# Altium schematic sheet PSU_VCC1V8AUX_Buck.SchDoc
size A3; SheetNumber: 6; SheetTotal: 32
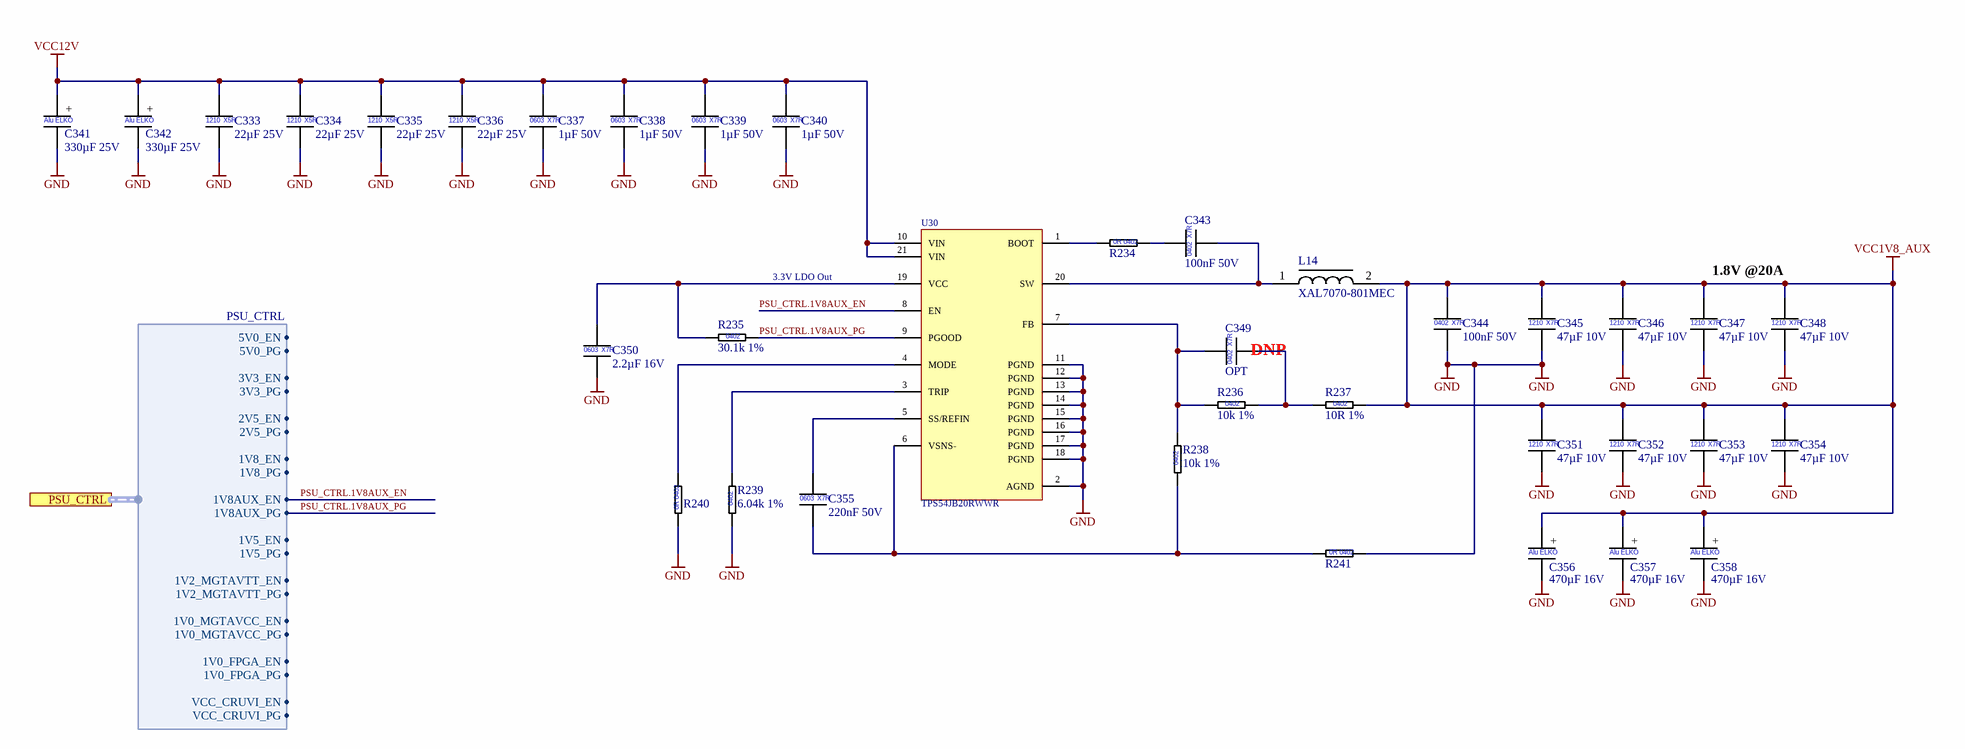
[diagram p0: PSU_VCC1V8AUX_Buck.SchDoc]

## Parts
C333  22µF 25V  [CAP_1210]
C334  22µF 25V  [CAP_1210]
C335  22µF 25V  [CAP_1210]
C336  22µF 25V  [CAP_1210]
C337  1µF 50V  [CAP_0603]
C338  1µF 50V  [CAP_0603]
C339  1µF 50V  [CAP_0603]
C340  1µF 50V  [CAP_0603]
C341  330µF 25V  [WCAP-PTG5_D10H12.5]
C342  330µF 25V  [WCAP-PTG5_D10H12.5]
C343  100nF 50V  [CAP_0402]
C344  100nF 50V  [CAP_0402]
C345  47µF 10V  [CAP_1210]
C346  47µF 10V  [CAP_1210]
C347  47µF 10V  [CAP_1210]
C348  47µF 10V  [CAP_1210]
C349  OPT  [CAP_0402]  (no BOM)
C350  2.2µF 16V  [CAP_0603]
C351  47µF 10V  [CAP_1210]
C352  47µF 10V  [CAP_1210]
C353  47µF 10V  [CAP_1210]
C354  47µF 10V  [CAP_1210]
C355  220nF 50V  [CAP_0603]
C356  470µF 16V  [WCAP-PTG5_D8H13]
C357  470µF 16V  [WCAP-PTG5_D8H13]
C358  470µF 16V  [WCAP-PTG5_D8H13]
L14  XAL7070-801MEC  [COILCRAFT_XAL7070]
R234  0R Jumper  [RES_0402]  (value not drawn)
R235  30.1k 1%  [RES_0402]
R236  10k 1%  [RES_0402]
R237  10R 1%  [RES_0402]
R238  10k 1%  [RES_0402]
R239  6.04k 1%  [RES_0402]
R240  0R Jumper  [RES_0402]  (value not drawn)
R241  0R Jumper  [RES_0402]  (value not drawn)
U30  TPS54JB20RWWR  [VQFN-HR21_RWW0021A]

## Ports
PSU_CTRL (harness PSU_CTRL, see Power-Tree[2B], PSU_MGTAVCC_Buck[1B], PSU_MGTAVTT_Buck[1B], PSU_VCC1V0_FPGA_Buck[1B], PSU_VCC1V5_Buck[1B], PSU_VCC1V8_Buck[1B], PSU_VCC2V5_Buck[1B], PSU_VCC3V3_Buck[1B], PSU_VCC5V_Buck[1B], PSU_VCC_CRUVI_ADJ_Buck[1B])

## Harnesses
PSU_CTRL: 5V0_EN, 5V0_PG, 3V3_EN, 3V3_PG, 2V5_EN, 2V5_PG, 1V8_EN, 1V8_PG, 1V8AUX_EN, 1V8AUX_PG, 1V5_EN, 1V5_PG, 1V2_MGTAVTT_EN, 1V2_MGTAVTT_PG, 1V0_MGTAVCC_EN, 1V0_MGTAVCC_PG, 1V0_FPGA_EN, 1V0_FPGA_PG, VCC_CRUVI_EN, VCC_CRUVI_PG

## Nets
GND: C333.2 C334.2 C335.2 C336.2 C337.2 C338.2 C339.2 C340.2 C341.2 C342.2 C344.2 C345.2 C346.2 C347.2 C348.2 C350.2 C351.2 C352.2 C353.2 C354.2 C356.2 C357.2 C358.2 R239.1 R240.1 R241.2 U30.2(AGND) U30.11(PGND) U30.12(PGND) U30.13(PGND) U30.14(PGND) U30.15(PGND) U30.16(PGND) U30.17(PGND) U30.18(PGND)
VCC1V8_AUX: C344.1 C345.1 C346.1 C347.1 C348.1 C351.1 C352.1 C353.1 C354.1 C356.1 C357.1 C358.1 L14.2 R237.2
VCC12V: C333.1 C334.1 C335.1 C336.1 C337.1 C338.1 C339.1 C340.1 C341.1 C342.1 U30.10(VIN) U30.21(VIN)
PSU_CTRL.1V8AUX_EN: U30.8(EN) ; port PSU_CTRL.1V8AUX_EN
PSU_CTRL.1V8AUX_PG: R235.2 U30.9(PGOOD) ; port PSU_CTRL.1V8AUX_PG
NetC343_1: C343.1 R234.2
NetC343_2: C343.2 L14.1 U30.20(SW)
NetC349_1: C349.1 R236.1 R238.2 U30.7(FB)
NetC349_2: C349.2 R236.2 R237.1
NetC350_1: C350.1 R235.1 U30.19(VCC)
NetC355_1: C355.1 U30.5(SS/REFIN)
NetC355_2: C355.2 R238.1 R241.1 U30.6(VSNS-)
NetR234_1: R234.1 U30.1(BOOT)
NetR239_2: R239.2 U30.3(TRIP)
NetR240_2: R240.2 U30.4(MODE)

## Notes on the sheet
- 3.3V LDO Out
- (near C348) 1.8V @20A
- (near C349) DNP
- Company:
- Contact:
- Customer:
- mail@pcb-arts.com
- PCB Arts GmbH
- Title:
- Project:
- The  information  contained  in  these  documents  is  confidential,  privileged  and  only  for  the information of the intended recipient and may not be used, published or redistributed Without the prior written consent from PCB Arts GmbH.
- Engineer:
- Document Number:
- Revision:
- Variant:
- Date:
- Time:
- Sheet:
- Status:
- /
- (in symbol CAP_0402_100nF_50V) X7R; 0402
- (in symbol CAP_0402_OPT) X7R; 0402
- (in symbol CAP_0603_1µF_50V_X7R_10%) 0603; X7R
- (in symbol CAP_0603_2.2µF_16V_X7R_10%) 0603; X7R
- (in symbol CAP_0603_220nF_50V_X7R_10%) 0603; X7R
- (in symbol CAP_1210_22µF_25V) 1210; X5R
- (in symbol CAP_1210_47µF_10V_X7R_10%) 1210; X7R
- (in symbol CAP_D8L9_470µF_16V) +; Alu ELKO
- (in symbol CAP_D10L12.5_330µF_25V) +; Alu ELKO
- (in symbol RES_0402_0R Jumper) 0R 0402
- (in symbol RES_0402_6.04k_1%) 0402
- (in symbol RES_0402_10k_1%) 0402
- (in symbol RES_0402_10R_1%) 0402
- (in symbol RES_0402_30.1k_1%) 0402

## Library data of the parts
C333-C336 = CAP_1210_22µF_25V: Multilayer Ceramic Capacitors MLCC - SMD/SMT 1210 25VDC; Manufacturer 1: KEMET; Manufacturer 1 Prt. Nr.: C1210C226K3PACTU; Manufacturer 2 Prt. Nr.: TMK212BBJ226MG-TT; Manufacturer 2: Taiyo Yuden
C337-C340 = CAP_0603_1µF_50V_X7R_10%: Multilayer Ceramic Capacitors MLCC - SMD/SMT 50V 1uF X7R 0603 10%; Manufacturer 1: KYOCERA AVX; Manufacturer 1 Prt. Nr.: 06035C105KAT2A; Manufacturer 2 Prt. Nr.: MSASU168AB7105KTNA01; Manufacturer 2: TAIYO YUDEN
C341 C342 = CAP_D10L12.5_330µF_25V: Organische Polymer-Aluminiumkondensatoren 330uF 25 Volts 20% AEC-Q200; Manufacturer 1: Würth Elektronik; Manufacturer 1 Prt. Nr.: 870025575009
C343 C344 = CAP_0402_100nF_50V: Multilayer Ceramic Capacitors MLCC - SMD/SMT 0402 50VDC; Manufacturer 1: Murata Electronics; Manufacturer 1 Prt. Nr.: GCM155L8EH104KE07D; Manufacturer 2 Prt. Nr.: UMK105B7104KV-FR; Manufacturer 2: TDK
C345-C348 C351-C354 = CAP_1210_47µF_10V_X7R_10%: Multilayer Ceramic Capacitors MLCC - SMD/SMT 47 uF 10 VDC 10% 1210 X7R; Manufacturer 1: Murata Electronics; Manufacturer 1 Prt. Nr.: GRM32ER71A476KE15L; Manufacturer 2 Prt. Nr.: C1210C106K8RACTU; Manufacturer 2: KEMET
C349 = CAP_0402_OPT: Multilayer Ceramic Capacitors MLCC - SMD/SMT 0402 Optional Placeholder
C350 = CAP_0603_2.2µF_16V_X7R_10%: Multilayer Ceramic Capacitors MLCC - SMD/SMT 2.2 uF 16 VDC 10% 0603 X7R; Manufacturer 1: Murata Electronics; Manufacturer 1 Prt. Nr.: GRM188Z71C225KE43D; Manufacturer 2 Prt. Nr.: EMK107BB7225KA-T; Manufacturer 2: TAIYO YUDEN
C355 = CAP_0603_220nF_50V_X7R_10%: Multilayer Ceramic Capacitors MLCC - SMD/SMT 0.22 uF 50 VDC 10% 0603 X7R; Manufacturer 1: Murata Electronics; Manufacturer 1 Prt. Nr.: GRJ188R71H224KE11D; Manufacturer 2 Prt. Nr.: CGA3E3X7R1H224K080AE; Manufacturer 2: TDK
C356-C358 = CAP_D8L9_470µF_16V: Organische Polymer-Aluminiumkondensatoren 470uF 16 Volts 20%; Manufacturer 1: Würth Elektronik; Manufacturer 1 Prt. Nr.: 870025374007
L14 = XAL7070-801MEC_Power Inductors SMD 800nH Shld 20% 25.8A 2.29mOhms AECQ200: Power Inductors - SMD 800nH Shld 20% 25.8A 2.29mOhms AECQ200; Manufacturer 1: Coilcraft; Manufacturer 1 Prt. Nr.: XAL7070-801MEC
R234 R240 R241 = RES_0402_0R Jumper: Thick Film Resistors - SMD 0Ohm; Manufacturer 1: Vishay / Dale; Manufacturer 1 Prt. Nr.: CRCW04020000Z0EDC; Manufacturer 2 Prt. Nr.: RC0402JR-070RL; Manufacturer 2: Yageo
R235 = RES_0402_30.1k_1%: Thick Film Resistors - SMD 30.1kOhm 1%; Manufacturer 1: Vishay / Dale; Manufacturer 1 Prt. Nr.: CRCW040230K1FKEDC; Manufacturer 2 Prt. Nr.: RC0402FR-1330K1L; Manufacturer 2: Yageo
R236 R238 = RES_0402_10k_1%: Thick Film Resistors - SMD 10kOhm 1%; Manufacturer 1: Vishay / Dale; Manufacturer 1 Prt. Nr.: CRCW040210K0FKEDC; Manufacturer 2 Prt. Nr.: RC0402FR-7W10KL; Manufacturer 2: Yageo
R237 = RES_0402_10R_1%: Thick Film Resistors - SMD 10Ohm 1%; Manufacturer 1: Vishay / Dale; Manufacturer 1 Prt. Nr.: CRCW040210R0FKEE; Manufacturer 2 Prt. Nr.: RC0402FR-7W10RL; Manufacturer 2: Yageo
R239 = RES_0402_6.04k_1%: Thick Film Resistors - SMD 6.04kOhm 1%; Manufacturer 1: Vishay / Dale; Manufacturer 1 Prt. Nr.: CRCW04026K04FKEDC; Manufacturer 2 Prt. Nr.: RC0402FR-7W6K04L; Manufacturer 2: Yageo
U30 = TPS54JB20RWWR_Switching Voltage Regulators 2.7-V to 16-V input 20-A synchronous Buck: Switching Voltage Regulators 2.7-V to 16-V input 20-A synchronous Buck; Manufacturer 1: Texas Instruments; Manufacturer 1 Prt. Nr.: TPS54JB20RWWR